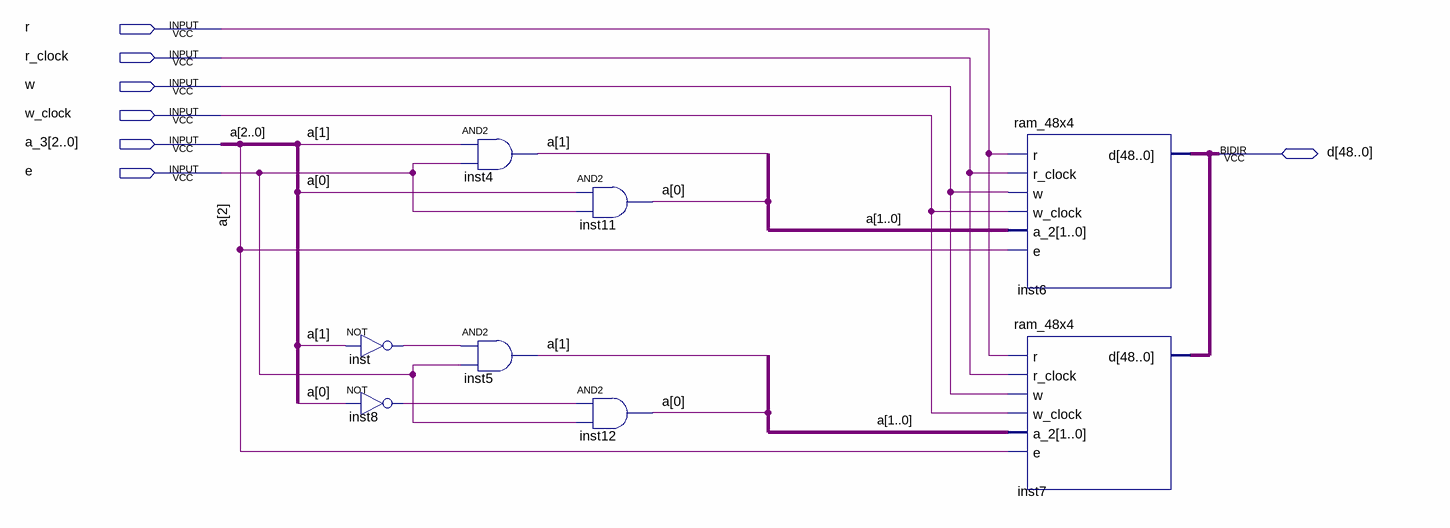
[diagram p0: schematic sheet]
// Quartus schematic ram_48x8.bdf as structural Verilog: 8 symbols, 7 pins
module ram_48x8 (
  input  r,
  input  r_clock,
  input  w,
  input  w_clock,
  input  [2:0] a_3,
  input  e,
  inout  [48:0] d
);

  wire inst8_out, inst_out;

  not inst (inst_out, a_3[1]);
  not inst8 (inst8_out, a_3[0]);
  and inst4 (a_3[1], a_3[1], e);
  and inst5 (a_3[1], inst_out, e);
  and inst11 (a_3[0], a_3[0], e);
  and inst12 (a_3[0], inst8_out, e);
  ram_48x4 inst6 (.r(r), .r_clock(r_clock), .w(w), .w_clock(w_clock), .a_2(a_3[1:0]), .e(a_3[2]), .d(d));
  ram_48x4 inst7 (.r(r), .r_clock(r_clock), .w(w), .w_clock(w_clock), .a_2(a_3[1:0]), .e(a_3[2]), .d(d));

  // Other names for the same wires on the sheet: a[2:0] = a_3
endmodule
